# EAGLE design mainboard (EAGLE 9.6.2)
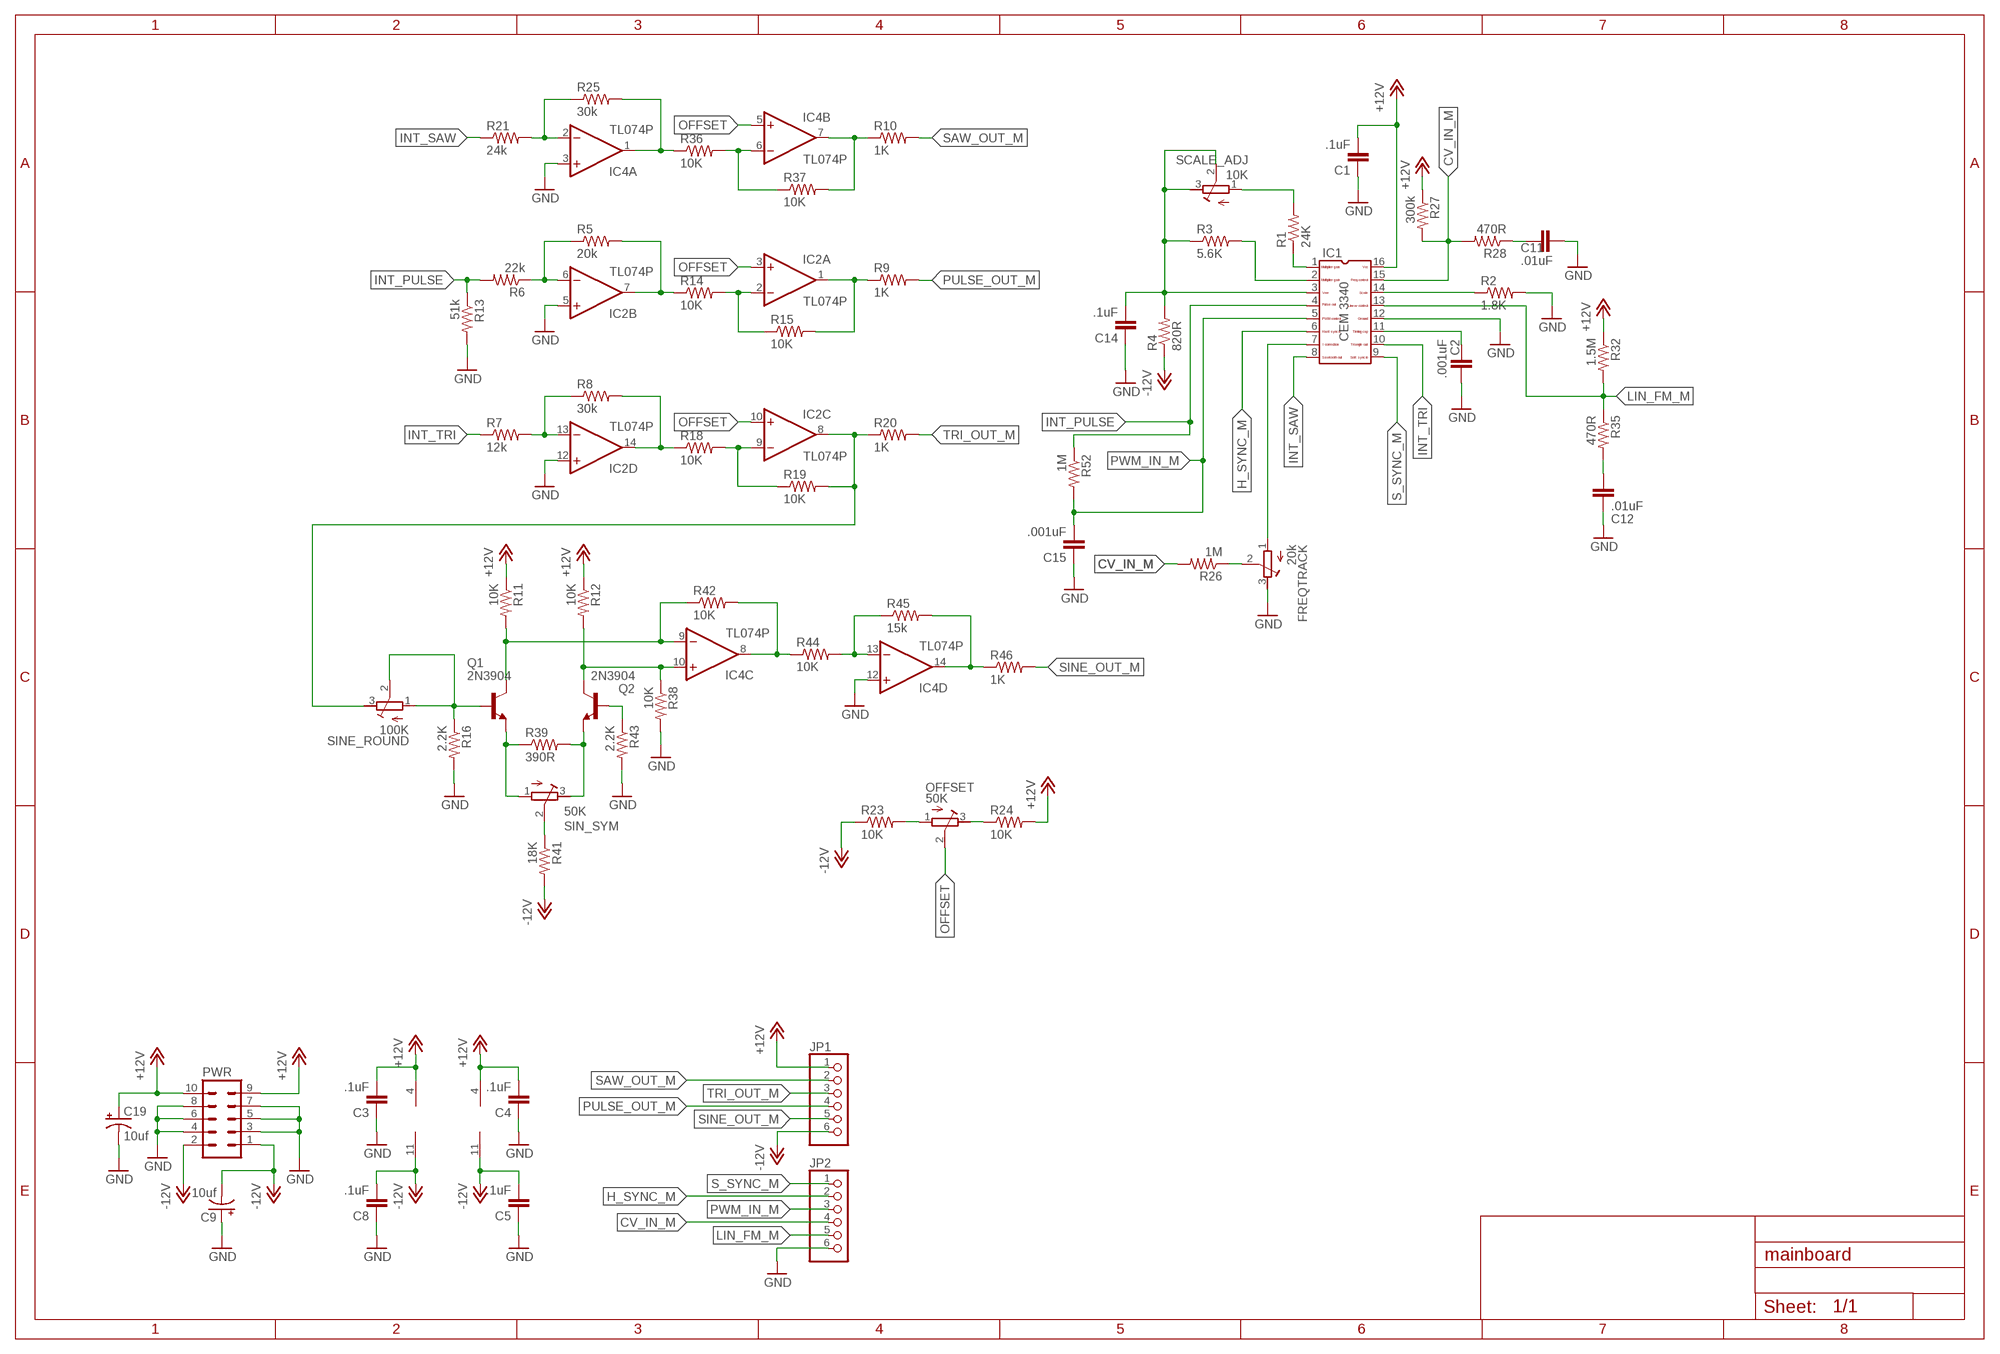
[diagram p0: schematic, sheet 1]

## Parts
C1  .1uF  C-EU050-024X044  [C050-024X044]
C2  .001uF  C-EU150-054X183  [C150-054X183]
C3  .1uF  C-EU050-024X044  [C050-024X044]
C4  .1uF  C-EU050-024X044  [C050-024X044]
C5  .1uF  C-EU050-024X044  [C050-024X044]
C8  .1uF  C-EU050-024X044  [C050-024X044]
C9  10uf  CPOL-USE2.5-5  [E2,5-5]
C11  .01uF  C-EU050-024X044  [C050-024X044]
C12  .01uF  C-EU050-024X044  [C050-024X044]
C14  .1uF  C-EU050-024X044  [C050-024X044]
C15  .001uF  C-EU050-024X044  [C050-024X044]
C19  10uf  CPOL-USE2.5-5  [E2,5-5]
FREQTRACK  20k  R-TRIMM3296W  [RTRIM3296W]
IC1  CEM3340  [DIL16]
IC2  TL074P  [DIL14]
IC4  TL074P  [DIL14]
JP1  PINHD-1X6  [1X06]
JP2  PINHD-1X6  [1X06]
OFFSET  50K  R-TRIMM3296W  [RTRIM3296W]
PWR  ML10  [ML10]
Q1  2N3904  [TO92]
Q2  2N3904  [TO92]
R1  24K  R-US_0207/7  [0207/7]
R2  1.8K  R-US_0207/7  [0207/7]
R3  5.6K  R-US_0207/7  [0207/7]
R4  820R  R-US_0207/7  [0207/7]
R5  20k  R-US_0207/7  [0207/7]
R6  22k  R-US_0207/7  [0207/7]
R7  12k  R-US_0207/7  [0207/7]
R8  30k  R-US_0207/7  [0207/7]
R9  1K  R-US_0207/7  [0207/7]
R10  1K  R-US_0207/7  [0207/7]
R11  10K  R-US_0207/7  [0207/7]
R12  10K  R-US_0207/7  [0207/7]
R13  51k  R-US_0207/7  [0207/7]
R14  10K  R-US_0207/7  [0207/7]
R15  10K  R-US_0207/7  [0207/7]
R16  2.2K  R-US_0207/7  [0207/7]
R18  10K  R-US_0207/7  [0207/7]
R19  10K  R-US_0207/7  [0207/7]
R20  1K  R-US_0207/7  [0207/7]
R21  24k  R-US_0207/7  [0207/7]
R23  10K  R-US_0207/7  [0207/7]
R24  10K  R-US_0207/7  [0207/7]
R25  30k  R-US_0207/7  [0207/7]
R26  1M  R-US_0207/7  [0207/7]
R27  300k  R-US_0207/7  [0207/7]
R28  470R  R-US_0207/7  [0207/7]
R32  1.5M  R-US_0207/7  [0207/7]
R35  470R  R-US_0207/7  [0207/7]
R36  10K  R-US_0207/7  [0207/7]
R37  10K  R-US_0207/7  [0207/7]
R38  10K  R-US_0207/7  [0207/7]
R39  390R  R-US_0207/7  [0207/7]
R41  18K  R-US_0207/7  [0207/7]
R42  10K  R-US_0207/7  [0207/7]
R43  2.2K  R-US_0207/7  [0207/7]
R44  10K  R-US_0207/7  [0207/7]
R45  15k  R-US_0207/7  [0207/7]
R46  1K  R-US_0207/7  [0207/7]
R52  1M  R-US_0207/7  [0207/7]
SCALE_ADJ  10K  R-TRIMM3296W  [RTRIM3296W]
SIN_SYM  50K  R-TRIMM3296W  [RTRIM3296W]
SINE_ROUND  100K  R-TRIMM3296W  [RTRIM3296W]

## Nets
+12V: C1.2 C3.2 C4.2 C19.+ IC1.16 IC2.4(P:V+) IC4.4(P:V+) JP1.1 PWR.9 PWR.10 R11.1 R12.1 R24.2 R27.1 R32.1
-12V: C5.2 C8.2 C9.- IC2.11(P:V-) IC4.11(P:V-) JP1.6 PWR.1 PWR.2 R4.1 R23.1 R41.2
CV_IN_M: IC1.15 JP2.4 R26.2 R27.2 R28.2
GND: C1.1 C2.2 C3.1 C4.1 C5.1 C8.1 C9.+ C11.1 C12.2 C14.1 C15.1 C19.- FREQTRACK.3(E) IC1.12 IC2.5(B:+IN) IC2.12(D:+IN) IC4.3(A:+IN) IC4.12(D:+IN) JP2.6 PWR.3 PWR.4 PWR.5 PWR.6 PWR.7 PWR.8 R2.2 R13.2 R16.2 R38.2 R43.2
H_SYNC_M: IC1.6 JP2.2
HF_CORRECTION: FREQTRACK.1(A) IC1.7
INT_PULSE: IC1.4 R6.2 R13.1 R52.1
INT_SAW: IC1.8 R21.1
INT_TRI: IC1.10 R7.1
LIN_FM_M: IC1.13 JP2.5 R32.2 R35.1
N$1: IC1.1 R1.1
N$2: C2.1 IC1.11
N$3: IC1.14 R2.1
N$4: IC1.2 R3.2
N$5: Q1.2(B) R16.1 SINE_ROUND.1(A) SINE_ROUND.2(S)
N$6: IC2.6(B:-IN) R5.1 R6.1
N$8: C14.2 IC1.3 R3.1 R4.2 SCALE_ADJ.2(S) SCALE_ADJ.3(E)
N$10: R1.2 SCALE_ADJ.1(A)
N$11: IC4.1(A:OUT) R25.2 R36.1
N$12: IC4.9(C:-IN) Q1.1(C) R11.2 R42.1
N$13: IC2.13(D:-IN) R7.2 R8.1
N$14: IC4.10(C:+IN) Q2.1(C) R12.2 R38.1
N$15: IC2.14(D:OUT) R8.2 R18.1
N$16: IC2.7(B:OUT) R5.2 R14.1
N$17: IC2.2(A:-IN) R14.2 R15.1
N$18: R41.1 SIN_SYM.2(S)
N$19: Q1.3(E) R39.1 SIN_SYM.1(A)
N$20: IC2.9(C:-IN) R18.2 R19.1
N$21: OFFSET.1(A) R23.2
N$22: OFFSET.3(E) R24.1
N$23: FREQTRACK.2(S) R26.1
N$24: C11.2 R28.1
N$25: IC2.1(A:OUT) R9.1 R15.2
N$28: IC4.6(B:-IN) R36.2 R37.1
N$29: C12.1 R35.2
N$30: IC2.8(C:OUT) R19.2 R20.1 SINE_ROUND.3(E)
N$31: Q2.3(E) R39.2 SIN_SYM.3(E)
N$32: IC4.2(A:-IN) R21.2 R25.1
N$33: IC4.8(C:OUT) R42.2 R44.1
N$34: IC4.7(B:OUT) R10.1 R37.2
N$36: Q2.2(B) R43.1
N$39: IC4.14(D:OUT) R45.2 R46.1
N$40: IC4.13(D:-IN) R44.2 R45.1
OFFSET: IC2.3(A:+IN) IC2.10(C:+IN) IC4.5(B:+IN) OFFSET.2(S)
PULSE_OUT_M: JP1.4 R9.2
PWM_IN_M: C15.2 IC1.5 JP2.3 R52.2
S_SYNC_M: IC1.9 JP2.1
SAW_OUT_M: JP1.2 R10.2
SINE_OUT_M: JP1.5 R46.2
TRI_OUT_M: JP1.3 R20.2

## Library data of the parts
C1 C3-C5 C8 C11 C12 C14 C15 = resistor:C-EU: CAPACITOR, European symbol
C2 = rcl:C-EU: CAPACITOR, European symbol; SPICEPREFIX: C
C9 C19 = resistor:CPOL-US: POLARIZED CAPACITOR, American symbol
FREQTRACK OFFSET SCALE_ADJ SIN_SYM SINE_ROUND = resistor:R-TRIMM: Trimm resistor
IC1 = CEM:CEM3340: CEM 3340 VCO
IC2 IC4 = linear:TL074: OP AMP
JP1 JP2 = pinhead:PINHD-1X6: PIN HEADER
PWR = con-ml:ML10: HARTING; OC_FARNELL: unknown; OC_NEWARK: unknown
Q1 Q2 = transistor-npn:2N3904: NPN Transistor
R1-R16 R18-R21 R23-R28 R32 R35-R39 R41-R46 R52 = resistor:R-US_: RESISTOR, American symbol

## Board
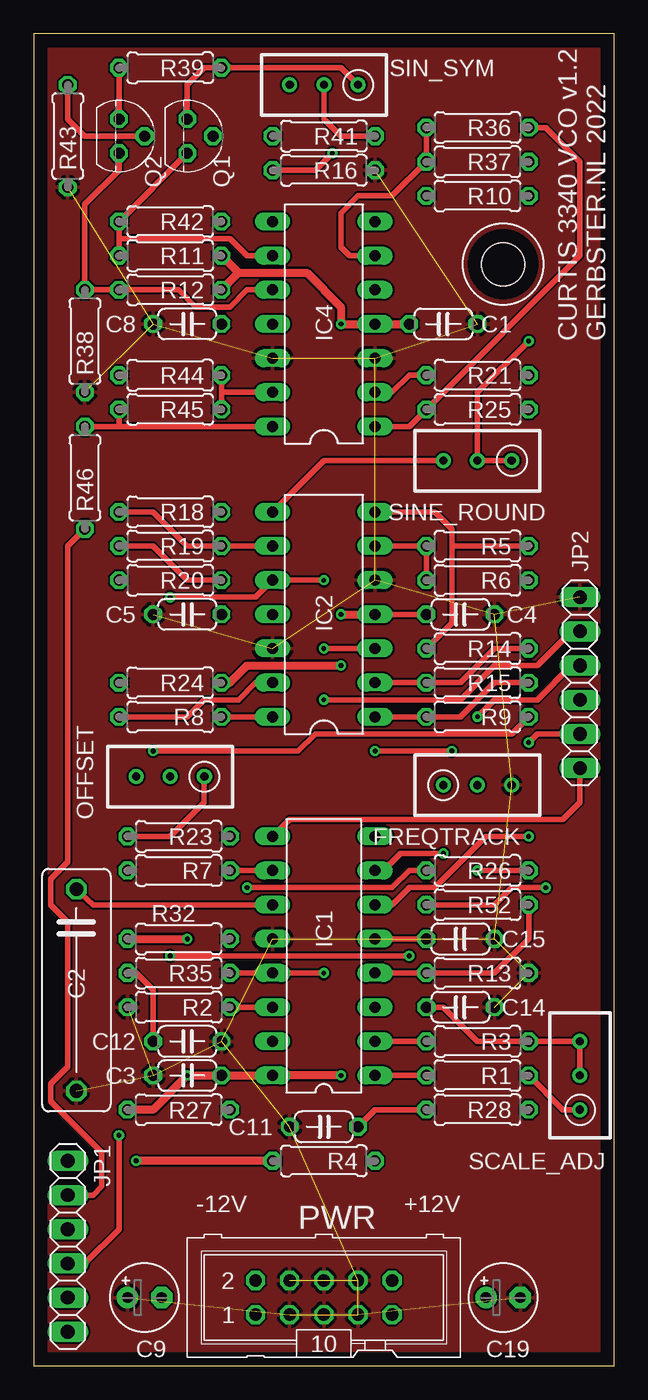
[diagram p1: board, top side]
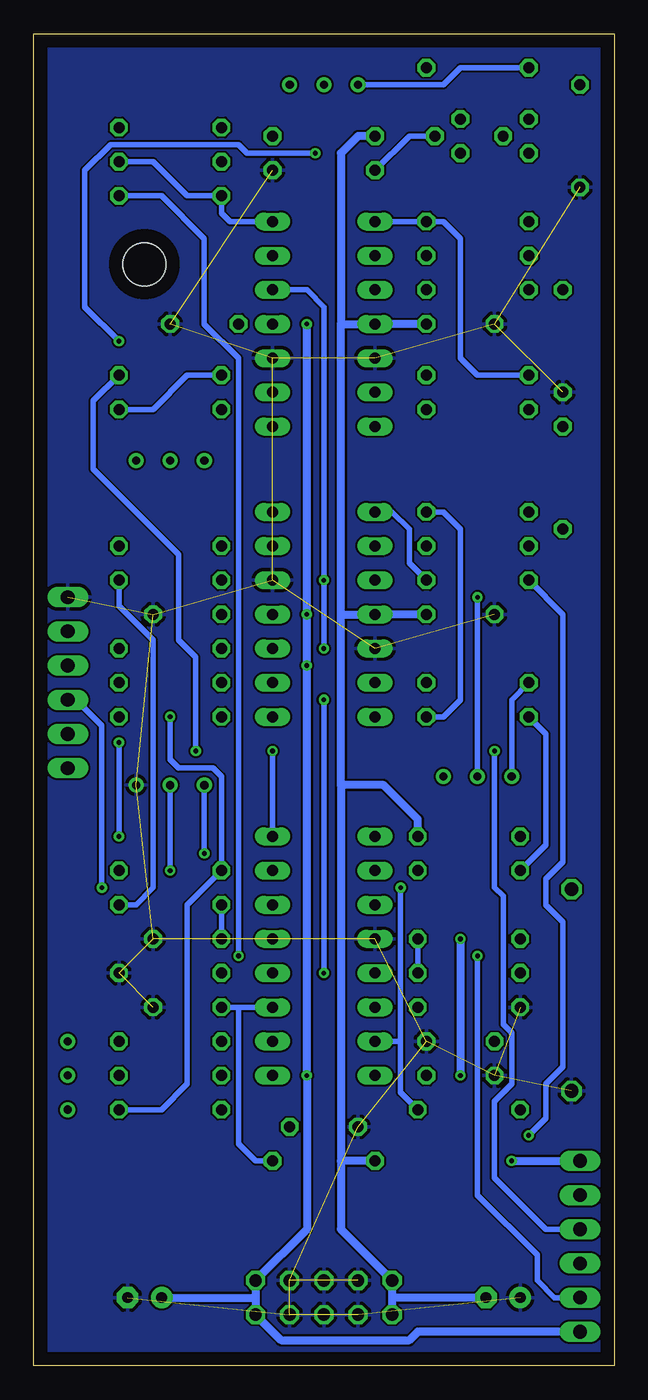
[diagram p2: board, bottom side, seen from below]

Size 43.18 x 99.06 mm. Coordinates in mm from the lower left corner, seen from the top.
Outline: 43.18,0 43.18,99.06 0,99.06 0,0 43.18,0
Copper layers (1*16): Top 0.035mm / dielectric 1.5mm / Bottom 0.035mm
Design rules "default": minimum track width 6mil, minimum drill 0.35mm, track to track 6mil, track to pad 6mil, pad to pad 6mil, via to via 6mil, smd to smd 6mil, copper to edge 40mil, drill to drill 6mil, minimum pad ring 10mil, minimum via ring 8mil, stop-mask expansion 4mil, vias tented up to drill 0mil, thermal gap 10mil
Holes 3.2 mm at 34.92,81.92

### Footprints (pad centres in the part's own frame; a part is rotated, then mirrored left to right if it is on the bottom)
C050-024X044 = drill 0.813 octagon: 1 -2.54,0; 2 2.54,0
C150-054X183 = drill 1.016 octagon: 1 -7.493,0; 2 7.493,0
E2,5-5 = drill 0.813 pad 1.6: + -1.27,0 | drill 0.813 pad 1.6 octagon: - 1.27,0
RTRIM3296W = drill 0.61: 1 0,-2.54; 2 0,0; 3 0,2.54
DIL16 = drill 0.813 long: 1 -8.89,-3.81; 2 -6.35,-3.81; 3 -3.81,-3.81; 4 -1.27,-3.81; 5 1.27,-3.81; 6 3.81,-3.81; 7 6.35,-3.81; 8 8.89,-3.81; 9 8.89,3.81; 10 6.35,3.81; 11 3.81,3.81; 12 1.27,3.81; 13 -1.27,3.81; 14 -3.81,3.81; 15 -6.35,3.81; 16 -8.89,3.81
DIL14 = drill 0.813 long: 1 -7.62,-3.81; 2 -5.08,-3.81; 3 -2.54,-3.81; 4 0,-3.81; 5 2.54,-3.81; 6 5.08,-3.81; 7 7.62,-3.81; 8 7.62,3.81; 9 5.08,3.81; 10 2.54,3.81; 11 0,3.81; 12 -2.54,3.81; 13 -5.08,3.81; 14 -7.62,3.81
1X06 = drill 1.016 long: 1 -6.35,0; 2 -3.81,0; 3 -1.27,0; 4 1.27,0; 5 3.81,0; 6 6.35,0
ML10 = drill 0.914 octagon: 1 -5.08,-1.27; 2 -5.08,1.27; 3 -2.54,-1.27; 4 -2.54,1.27; 5 0,-1.27; 6 0,1.27; 7 2.54,-1.27; 8 2.54,1.27; 9 5.08,-1.27; 10 5.08,1.27
TO92 = drill 0.813 octagon: 1 1.27,0; 2 0,1.905; 3 -1.27,0
0207/7 = drill 0.813 octagon: 1 -3.81,0; 2 3.81,0

### Placement (x,y rotation side)
C1  30.48,77.47 180 top
C2  3.17,27.94 270 top
C3  11.43,21.59 0 top
C4  31.75,55.88 180 top
C5  11.43,55.88 0 top
C8  11.43,77.47 0 top
C9  8.26,5.08 0 top
C11  21.59,17.78 0 top
C12  11.43,24.13 0 top
C14  31.75,26.67 180 top
C15  31.75,31.75 180 top
C19  34.92,5.08 0 top
FREQTRACK  33.02,43.18 270 top
IC1  21.59,30.48 90 top
IC2  21.59,55.88 90 top
IC4  21.59,77.47 90 top
JP1  2.54,8.89 90 top
JP2  40.64,50.8 90 top
OFFSET  10.16,43.81 90 top
PWR  21.59,5.08 0 top
Q1  11.43,91.44 270 top
Q2  6.35,91.44 270 top
R1  33.02,21.59 0 top
R2  10.79,26.67 180 top
R3  33.02,24.13 180 top
R4  21.59,15.24 0 top
R5  33.02,60.96 0 top
R6  33.02,58.42 0 top
R7  10.79,36.83 180 top
R8  10.16,48.26 0 top
R9  33.02,48.26 0 top
R10  33.02,87 0 top
R11  10.16,82.55 180 top
R12  10.16,80.01 180 top
R13  33.02,29.21 0 top
R14  33.02,53.34 0 top
R15  33.02,50.8 0 top
R16  21.59,88.9 0 top
R18  10.16,63.5 180 top
R19  10.16,60.96 180 top
R20  10.16,58.42 180 top
R21  33.02,73.66 180 top
R23  10.79,39.37 180 top
R24  10.16,50.8 0 top
R25  33.02,71.12 180 top
R26  33.02,36.83 180 top
R27  10.79,19.05 0 top
R28  33.02,19.05 0 top
R32  10.79,31.75 0 top
R35  10.79,29.21 180 top
R36  33.02,92.08 180 top
R37  33.02,89.53 0 top
R38  3.81,76.2 270 top
R39  10.16,96.52 180 top
R41  21.59,91.44 180 top
R42  10.16,85.09 0 top
R43  2.54,91.44 270 top
R44  10.16,73.66 0 top
R45  10.16,71.12 180 top
R46  3.81,66.04 270 top
R52  33.02,34.29 180 top
SCALE_ADJ  40.64,21.59 0 top
SIN_SYM  21.59,95.25 90 top
SINE_ROUND  33.02,67.31 90 top

### Tracks (layer width: path | path; a pad name or v marks a point on that pad's centre or on a via)
+12V  (via drill 0.35)
  Top 0.406: IC2.4 C4.2
  Top 0.61: R12.1 15.24,81.28 | 15.24,81.28 R11.1 | v22.86,21.59 IC1.16 C3.2 v11.43,21.59 8.89,19.05 R27.1 | v22.86,55.88 IC2.4 | 15.24,81.28 20.32,81.28 22.86,78.74 v22.86,77.47 IC4.4 C1.2 | R24.2 14.61,50.8 15.88,52.07 v22.86,52.07 | R32.1 v11.43,31.75
  Bottom 0.61: v22.86,77.47 v22.86,55.88 v22.86,52.07 v22.86,21.59 22.86,10.16 PWR.10 26.67,5.08 | v11.43,31.75 v11.43,21.59 | JP1.1 14.61,2.54 15.24,1.91 24.77,1.91 PWR.9 26.67,5.08 | C19.+ 26.67,5.08
-12V  (via drill 0.35)
  Top 0.61: R4.1 v7.62,15.24
  Bottom 0.61: C5.2 IC2.11 20.32,55.88 | C8.2 IC4.11 20.32,77.47 | 20.32,43.18 20.32,55.88 | 20.32,55.88 20.32,77.47 | R23.1 14.61,40.64 17.14,43.18 20.32,43.18 | 20.32,43.18 20.32,15.24 | 20.32,15.24 20.32,10.16 PWR.2 16.51,5.08 | R4.1 20.32,15.24 | v7.62,15.24 JP1.6 | R41.2 19.05,91.44 20.32,90.17 20.32,77.47 | 16.51,5.08 PWR.1 | C9.- 16.51,5.08
CV_IN_M  (via drill 0.35)
  Top 0.406: v15.88,35.56 26.67,35.56 27.94,36.83 R26.2 | v33.02,48.26 34.29,49.53 37.47,49.53 40.01,52.07 JP2.4
  Bottom 0.406: R27.2 15.88,20.32 15.88,24.13 | IC1.15 15.88,24.13 | v15.88,35.56 15.88,24.13 | R28.2 33.66,19.05 31.75,20.95 31.75,34.29 R26.2 29.21,43.81 29.84,44.45 32.38,44.45 33.02,45.09 v33.02,48.26
GND  (29 unrouted)
  pour Top: 0,0 43.18,0 43.18,99.06 0,99.06
  pour Bottom: 0,0 43.18,0 43.18,99.06 0,99.06
H_SYNC_M  (via drill 0.35)
  Top 0.406: IC1.6 26.67,34.29 27.94,35.56 29.84,35.56 33.66,39.37 v36.83,39.37 | v36.83,46.35 37.47,46.99 JP2.2
  Bottom 0.406: v36.83,39.37 v36.83,46.35
HF_CORRECTION  (via drill 0.35)
  Top 0.406: IC1.7 26.04,36.83 27.3,38.1 v30.48,38.1
  Bottom 0.406: v30.48,38.1 FREQTRACK.1
INT_PULSE
  Top 0.406: R52.1 36.83,31.75 34.29,29.21 R13.1 IC1.4
  Bottom 0.406: R6.2 36.83,56.52 34.29,53.98 34.29,35.56 35.56,34.29 R52.1
INT_SAW  (via drill 0.35)
  Top 0.406: v25.4,45.72 v31.11,45.72
  Bottom 0.406: IC1.8 v25.4,45.72 | v31.11,45.72 31.11,52.7 32.38,53.98 32.38,60.33 38.73,66.67 38.73,71.75 R21.1
INT_TRI
  Top 0.406: R7.1 IC1.10
LIN_FM_M  (via drill 0.35)
  Top 0.406: R35.1 IC1.13 | 17.14,29.21 IC1.13 | IC1.13 v21.59,29.21 | JP2.5 40.01,54.61 37.47,52.07 34.29,52.07 31.75,49.53 v21.59,49.53
  Bottom 0.406: R32.2 R35.1 | v21.59,29.21 v21.59,49.53
N$1
  Top 0.406: IC1.1 R1.1
N$2
  Top 0.406: C2.1 4.45,34.29 IC1.11
N$3
  Top 0.406: R2.1 IC1.14
N$4
  Top 0.406: IC1.2 R3.2
N$5  (via drill 0.35)
  Top 0.406: SINE_ROUND.1 SINE_ROUND.2 33.02,72.39 v36.83,76.2 | v22.23,90.17 20.95,88.9 R16.1
  Bottom 0.406: Q1.2 15.24,91.44 R16.1 | v36.83,76.2 39.37,78.74 39.37,88.9 37.47,90.81 27.94,90.81 27.3,90.17 v22.23,90.17
N$6
  Top 0.406: IC2.6 R5.1 R6.1
N$8
  Top 0.406: SCALE_ADJ.2 SCALE_ADJ.3 R3.1 33.02,24.13 30.48,26.67 C14.2
  Bottom 0.406: IC1.3 27.94,26.67 | 27.94,26.67 C14.2 | R4.2 26.67,15.24 27.94,16.51 27.94,26.67
N$10
  Top 0.406: R1.2 39.37,19.05 SCALE_ADJ.1
N$11
  Top 0.406: IC4.1 27.94,69.85 R25.2 40.64,82.55 40.64,89.53 38.1,92.08 R36.1
N$12
  Top 0.406: IC4.9 15.88,82.55 14.61,83.82 6.35,83.82 R42.1 | R11.2 R42.1 | Q1.1 R42.1
N$13
  Top 0.406: R8.1 11.43,48.26 12.7,49.53 15.24,49.53 16.51,50.8 IC2.13
  Bottom 0.406: R7.2 5.08,38.73 5.08,46.99 R8.1
N$14
  Top 0.406: IC4.10 15.88,80.01 14.61,78.74 12.06,78.74 10.79,80.01 R12.2 R38.1 3.81,86.36 6.35,88.9 Q2.1
N$15
  Top 0.406: R8.2 IC2.14
  Bottom 0.406: R8.2 12.7,48.26 11.43,49.53 11.43,62.23 12.7,63.5 R18.1
N$16
  Top 0.406: IC2.7 29.84,63.5 31.11,62.23 31.11,60.96 | 31.11,60.96 31.11,55.24 R14.1 | R5.2 31.11,60.96
N$17
  Top 0.406: IC2.2 R15.1 31.75,50.8 34.29,53.34 R14.2
N$18
  Top 0.406: R41.1 22.86,91.44 21.59,92.71 SIN_SYM.2
N$19
  Top 0.406: Q1.3 11.43,95.25 12.7,96.52 R39.1 22.86,96.52 SIN_SYM.1
N$20
  Top 0.406: R18.2 8.89,63.5 11.43,60.96 R19.1 IC2.9
N$21
  Top 0.406: R23.2 10.16,39.37 12.7,41.91 OFFSET.1
N$22
  Bottom 0.406: OFFSET.3 7.62,49.53 R24.1
N$23  (via drill 0.35)
  Top 0.406: R26.1 v33.02,36.83
  Bottom 0.406: v33.02,36.83 FREQTRACK.2
N$24
  Top 0.406: C11.2 25.4,19.05 R28.1
N$25
  Top 0.406: IC2.1 R9.1 31.75,48.26 34.29,50.8 R15.2
N$28
  Top 0.406: IC4.6 23.5,82.55 22.86,83.19 22.86,85.72 24.13,87 26.67,87 R37.1 R36.2
N$29
  Top 0.406: C12.1 8.89,27.94 7.62,29.21 R35.2
N$30
  Top 0.406: R19.2 8.89,60.96 11.43,58.42 R20.1 | IC2.8 21.59,67.31 SINE_ROUND.3
  Bottom 0.406: R20.1 15.24,59.69 15.24,62.23 16.51,63.5 IC2.8
N$31
  Top 0.406: R39.2 Q2.3
  Bottom 0.406: R39.2 11.43,96.52 12.7,95.25 SIN_SYM.3
N$32
  Top 0.406: IC4.2 26.67,72.39 27.94,73.66 R21.2
  Bottom 0.406: R25.1 34.29,71.12 31.75,73.66 R21.2
N$33
  Bottom 0.406: IC4.8 R42.2 12.7,85.09 11.43,83.82 11.43,74.93 10.16,73.66 R44.1
N$34
  Bottom 0.406: IC4.7 28.57,85.09 29.21,85.72 R10.1 31.75,87 34.29,89.53 R37.2
N$36
  Top 0.406: Q2.2 3.81,91.44 2.54,92.71 R43.1
N$39
  Top 0.406: R45.2 6.35,69.85 | 6.35,69.85 R46.1 | IC4.14 6.35,69.85
N$40
  Top 0.406: IC4.13 13.97,72.39 R44.2 R45.1
OFFSET  (via drill 0.35)
  Top 0.406: v21.59,58.42 IC2.10 16.51,57.15 v10.16,57.15 | v21.59,53.34 IC2.3
  Bottom 0.406: v21.59,53.34 v21.59,58.42 21.59,78.74 22.86,80.01 IC4.5 | OFFSET.2 v10.16,57.15
PULSE_OUT_M  (via drill 0.35)
  Top 0.406: v8.89,45.72 19.68,45.72 20.95,46.99 35.56,46.99 R9.2
  Bottom 0.406: v8.89,45.72 8.89,35.56 8.26,34.92 8.26,25.4 7.62,24.77 7.62,20.95 8.89,19.68 8.89,13.97 5.08,10.16 JP1.4
PWM_IN_M  (via drill 0.35)
  Top 0.406: IC1.5 C15.2 | R52.2 34.29,34.29 35.56,35.56 v38.1,35.56
  Bottom 0.406: C15.2 R52.2 | v38.1,35.56 38.1,47.62 40.01,49.53 JP2.3
S_SYNC_M
  Top 0.406: IC1.9 19.05,40.64 39.37,40.64 40.64,41.91 JP2.1
SAW_OUT_M  (via drill 0.35)
  Top 0.406: v27.94,30.48 v10.16,30.48
  Bottom 0.406: R10.2 33.66,87 30.48,83.82 30.48,77.47 27.94,74.93 v27.94,30.48 | JP1.2 4.45,5.08 5.71,6.35 5.71,8.26 10.16,12.7 v10.16,30.48
SINE_OUT_M
  Top 0.406: R46.2 2.54,60.96 2.54,37.47 1.27,36.2 1.27,34.29 2.54,33.02 2.54,22.23 1.27,20.95 1.27,19.68 5.08,15.88 5.08,13.34 4.45,12.7 JP1.5
TRI_OUT_M  (via drill 0.35)
  Top 0.406: JP1.3 3.81,7.62 6.35,10.16 v6.35,17.14
  Bottom 0.406: v6.35,17.14 5.08,18.41 5.08,20.95 3.81,22.23 3.81,33.02 5.08,34.29 5.08,36.2 3.81,37.47 3.81,55.88 R20.2

### Text on the board
tNames: CURTIS 3340 VCO v1.2 / GERBSTER.NL 2022 | -12V | +12V